# EAGLE schematic lego (EAGLE 6.4)
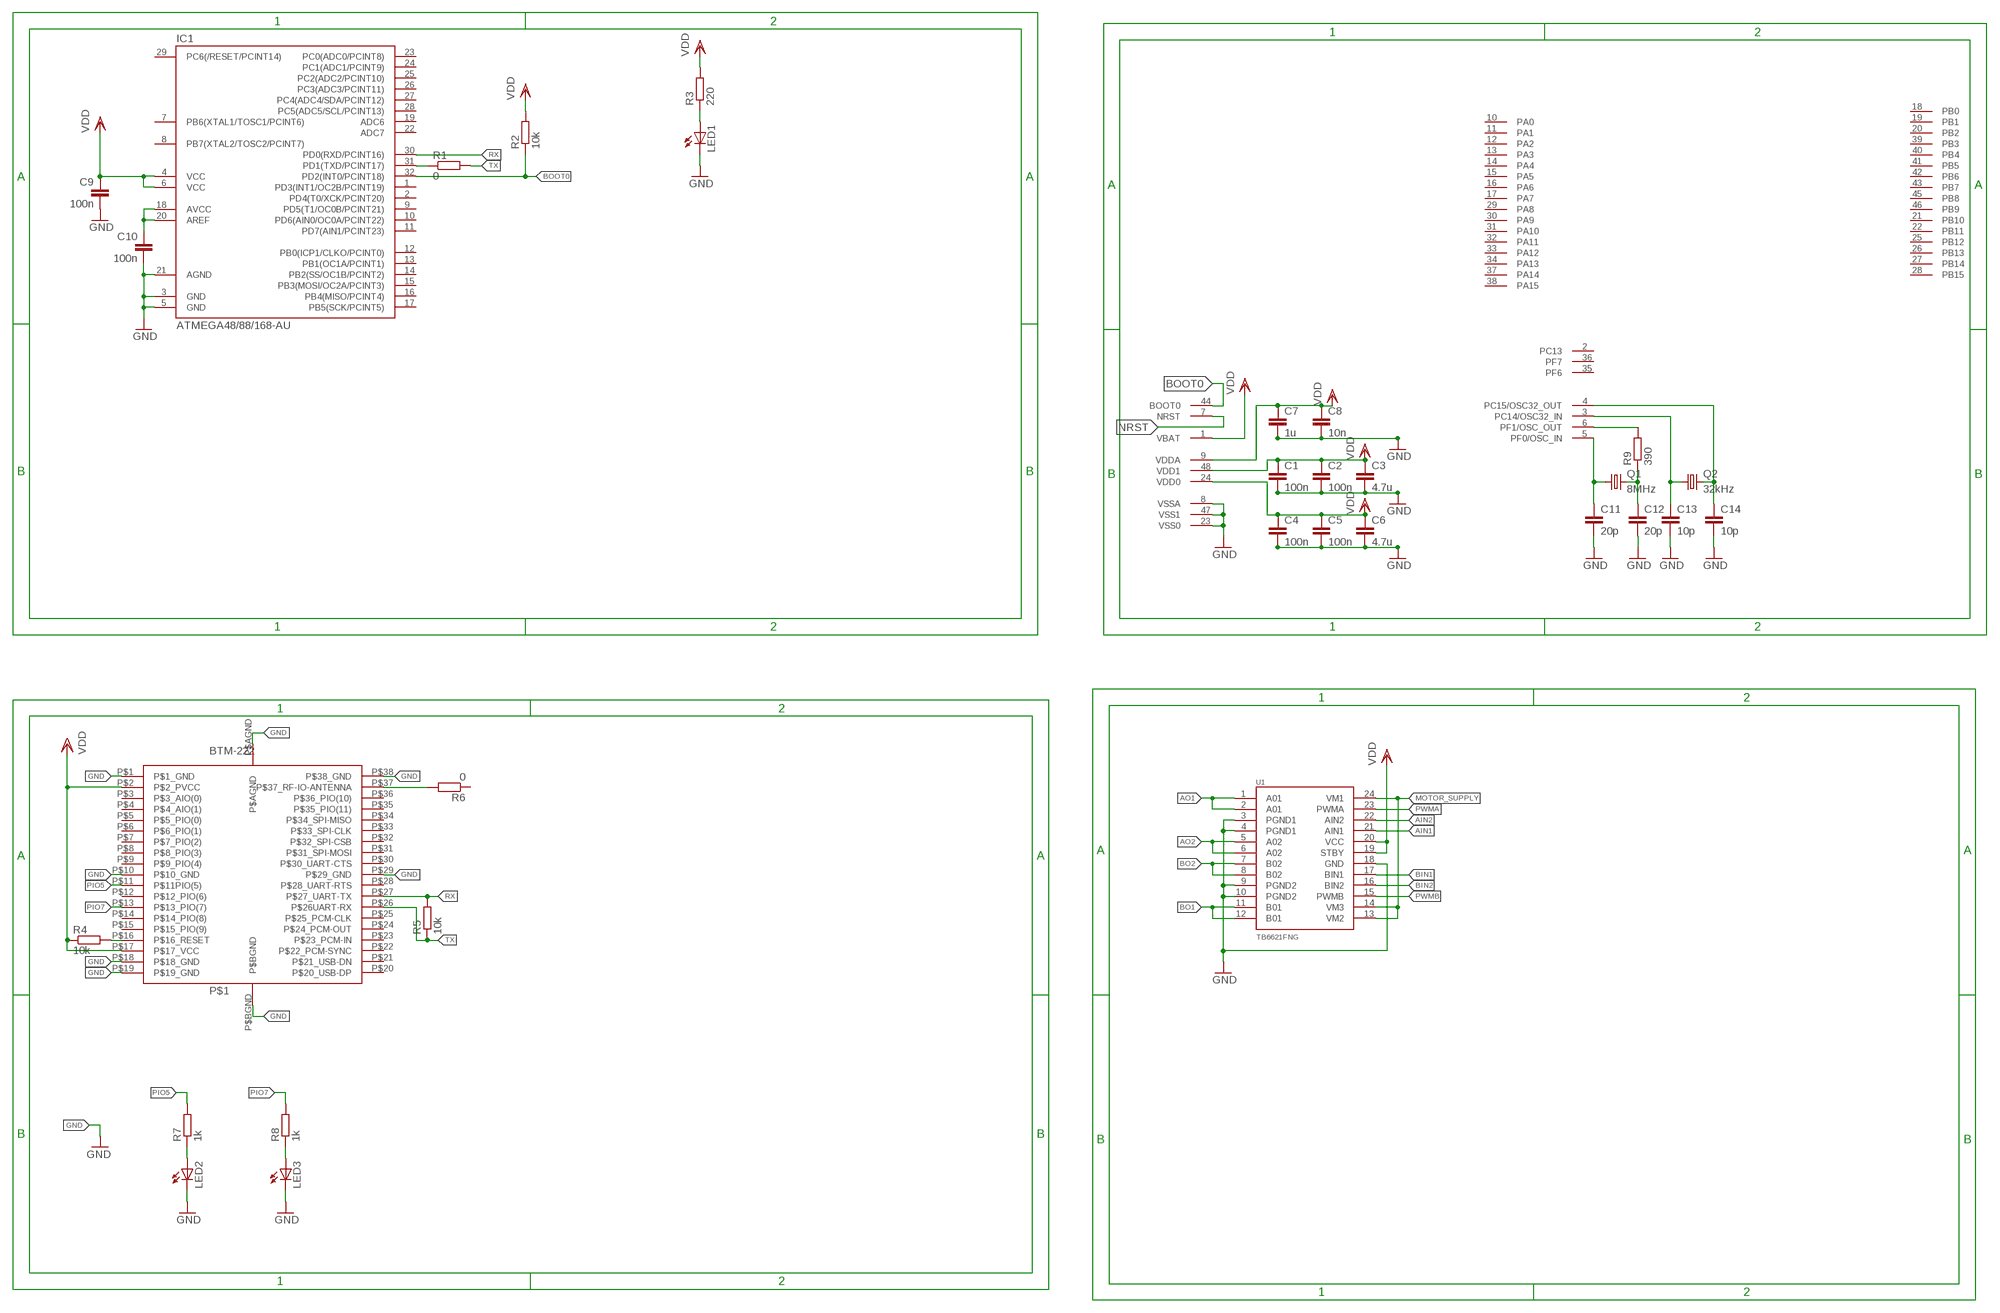
[diagram p0: schematic, sheet 1]

## Parts
C1  100n  C-EUC0805  [C0805]
C2  100n  C-EUC0805  [C0805]
C3  4.7u  C-EUC0805  [C0805]
C4  100n  C-EUC0805  [C0805]
C5  100n  C-EUC0805  [C0805]
C6  4.7u  C-EUC0805  [C0805]
C7  1u  C-EUC0805  [C0805]
C8  10n  C-EUC0805  [C0805]
C9  100n  C-EUC0805  [C0805]
C10  100n  C-EUC0805  [C0805]
C11  20p  C-EUC0805  [C0805]
C12  20p  C-EUC0805  [C0805]
C13  10p  C-EUC0805  [C0805]
C14  10p  C-EUC0805  [C0805]
IC1  ATMEGA48/88/168-AU  [TQFP32-08]
LED1  LEDSMT1206  [1206]
LED2  LEDSMT1206  [1206]
LED3  LEDSMT1206  [1206]
P$1  BTM-222  [BTM-222]
Q1  8MHz  CRYSTALHC49UP  [HC49UP]
Q2  32kHz  CRYSTALHC49UP  [HC49UP]
R1  0  R-EU_R0805  [R0805]
R2  10k  R-EU_R0805  [R0805]
R3  220  R-EU_R0805  [R0805]
R4  10k  R-EU_R0805  [R0805]
R5  10k  R-EU_R0805  [R0805]
R6  0  R-EU_R0805  [R0805]
R7  1k  R-EU_R0805  [R0805]
R8  1k  R-EU_R0805  [R0805]
R9  390  R-EU_R0805  [R0805]
U1  TB6621FNG  [SSOP24]
U$1  STM32F050  [LQFP48]

## Nets
AIN1: U1.21(AIN1)
AIN2: U1.22(AIN2)
AO1: U1.1(A01) U1.2(A01)
AO2: U1.5(A02) U1.6(A02)
BIN1: U1.17(BIN1)
BIN2: U1.16(BIN2)
BO1: U1.11(B01) U1.12(B01)
BO2: U1.7(B02) U1.8(B02)
BOOT0: IC1.32(PD2(INT0/PCINT18)) R2.1 U$1.44(BOOT0)
GND: C1.2 C2.2 C3.2 C4.2 C5.2 C6.2 C7.2 C8.2 C9.2 C10.2 C11.2 C12.2 C13.2 C14.2 IC1.3(GND) IC1.5(GND) IC1.21(AGND) LED1.C LED2.C LED3.C P$1.P$1(P$1_GND) P$1.P$10(P$10_GND) P$1.P$18(P$18_GND) P$1.P$19(P$19_GND) P$1.P$29(P$29_GND) P$1.P$38(P$38_GND) P$1.P$AGND P$1.P$BGND U1.3(PGND1) U1.4(PGND1) U1.9(PGND2) U1.10(PGND2) U1.18(GND) U$1.8(VSSA) U$1.23(VSS0) U$1.47(VSS1)
MOTOR_SUPPLY: U1.13(VM2) U1.14(VM3) U1.24(VM1)
N$1: IC1.31(PD1(TXD/PCINT17)) R1.1
N$2: C10.1 IC1.18(AVCC) IC1.20(AREF)
N$3: LED1.A R3.1
N$4: P$1.P$16(P$16_RESET) R4.2
N$5: P$1.P$37(P$37_RF-IO-ANTENNA) R6.2
N$6: LED2.A R7.1
N$7: LED3.A R8.1
N$8: R9.2 U$1.6(PF1/OSC_OUT)
N$9: C11.1 Q1.1 U$1.5(PF0/OSC_IN)
N$10: C12.1 Q1.2 R9.1
N$11: C13.1 Q2.1 U$1.3(PC14/OSC32_IN)
N$12: C14.1 Q2.2 U$1.4(PC15/OSC32_OUT)
NRST: U$1.7(NRST)
PIO5: P$1.P$11(P$11PIO(5)) R7.2
PIO7: P$1.P$13(P$13_PIO(7)) R8.2
PWMA: U1.23(PWMA)
PWMB: U1.15(PWMB)
RX: IC1.30(PD0(RXD/PCINT16)) P$1.P$27(P$27_UART-TX) R5.2
TX: P$1.P$26(P$26UART-RX) R1.2 R5.1
VDD: C1.1 C2.1 C3.1 C4.1 C5.1 C6.1 C7.1 C8.1 C9.1 IC1.4(VCC) IC1.6(VCC) P$1.P$2(P$2_PVCC) P$1.P$17(P$17_VCC) R2.2 R3.2 R4.1 U1.19(STBY) U1.20(VCC) U$1.1(VBAT) U$1.9(VDDA) U$1.24(VDD0) U$1.48(VDD1)
Unconnected: IC1.1(PD3(INT1/OC2B/PCINT19)) IC1.2(PD4(T0/XCK/PCINT20)) IC1.7(PB6(XTAL1/TOSC1/PCINT6)) IC1.8(PB7(XTAL2/TOSC2/PCINT7)) IC1.9(PD5(T1/OC0B/PCINT21)) IC1.10(PD6(AIN0/OC0A/PCINT22)) IC1.11(PD7(AIN1/PCINT23)) IC1.12(PB0(ICP1/CLKO/PCINT0)) IC1.13(PB1(OC1A/PCINT1)) IC1.14(PB2(SS/OC1B/PCINT2)) IC1.15(PB3(MOSI/OC2A/PCINT3)) IC1.16(PB4(MISO/PCINT4)) IC1.17(PB5(SCK/PCINT5)) IC1.19(ADC6) IC1.22(ADC7) IC1.23(PC0(ADC0/PCINT8)) IC1.24(PC1(ADC1/PCINT9)) IC1.25(PC2(ADC2/PCINT10)) IC1.26(PC3(ADC3/PCINT11)) IC1.27(PC4(ADC4/SDA/PCINT12)) IC1.28(PC5(ADC5/SCL/PCINT13)) IC1.29(PC6(/RESET/PCINT14)) P$1.P$3(P$3_AIO(0)) P$1.P$4(P$4_AIO(1)) P$1.P$5(P$5_PIO(0)) P$1.P$6(P$6_PIO(1)) P$1.P$7(P$7_PIO(2)) P$1.P$8(P$8_PIO(3)) P$1.P$9(P$9_PIO(4)) P$1.P$12(P$12_PIO(6)) P$1.P$14(P$14_PIO(8)) P$1.P$15(P$15_PIO(9)) P$1.P$20(P$20_USB-DP) P$1.P$21(P$21_USB-DN) P$1.P$22(P$22_PCM-SYNC) P$1.P$23(P$23_PCM-IN) P$1.P$24(P$24_PCM-OUT) P$1.P$25(P$25_PCM-CLK) P$1.P$28(P$28_UART-RTS) P$1.P$30(P$30_UART-CTS) P$1.P$31(P$31_SPI-MOSI) P$1.P$32(P$32_SPI-CSB) P$1.P$33(P$33_SPI-CLK) P$1.P$34(P$34_SPI-MISO) P$1.P$35(P$35_PIO(11)) P$1.P$36(P$36_PIO(10)) R6.1 U$1.2(PC13) U$1.10(PA0) U$1.11(PA1) U$1.12(PA2) U$1.13(PA3) U$1.14(PA4) U$1.15(PA5) U$1.16(PA6) U$1.17(PA7) U$1.18(PB0) U$1.19(PB1) U$1.20(PB2) U$1.21(PB10) U$1.22(PB11) U$1.25(PB12) U$1.26(PB13) U$1.27(PB14) U$1.28(PB15) U$1.29(PA8) U$1.30(PA9) U$1.31(PA10) U$1.32(PA11) U$1.33(PA12) U$1.34(PA13) U$1.35(PF6) U$1.36(PF7) U$1.37(PA14) U$1.38(PA15) U$1.39(PB3) U$1.40(PB4) U$1.41(PB5) U$1.42(PB6) U$1.43(PB7) U$1.45(PB8) U$1.46(PB9)

## Library data of the parts
C1-C14 = rcl:C-EU: CAPACITOR, European symbol
IC1 = atmega8:ATMEGA48/88/168
LED1-LED3 = led:LED: LED OSRAM: - CHIPLED LG R971, LG N971, LY N971, LG Q971, LY Q971, LO R971, LY R971 LH N974, LH R974 LS Q976, LO Q976, LY Q976 LO Q996 - Hyper CHIPLED LW Q18S LB Q993, LB Q99A, LB R99A - SideLED LS A670, LO A670, LY A670, LG A670, LP A670 LB A673, LV A673, LT A673, LW A673 LH A674 LY A675 LS A676, LA A676, LO A676, LY A676, LW A676 LS A679, LY A679, LG A679 - Hyper Micro SIDELED® LS Y876, LA Y876, LO Y876, LY Y876 LT Y87S - SmartLED LW L88C, LW L88S LB L89C, LB L89S, LG L890 LS L89K, LO L89K, LY L89K LS L896, LA L896, LO L896, LY L896 - TOPLED LS T670, LO T670, LY T670, LG T670, LP T670 LSG T670, LSP T670, LSY T670, LOP T670, LYG T670 LG T671, LOG T671, LSG T671 LB T673, LV T673, LT T673, LW T673 LH T674 LS T676, LA T676, LO T676, LY T676, LB T676, LH T676, LSB T676, LW T676 LB T67C, LV T67C, LT T67C, LS T67K, LO T67K, LY T67K, LW E67C LS E67B, LA E67B, LO E67B, LY E67B, LB E67C, LV E67C, LT E67C LW T67C LS T679, LY T679, LG T679 LS T770, LO T770, LY T770, LG T770, LP T770 LB T773, LV T773, LT T773, LW T773 LH T774 LS E675, LA E675, LY E675, LS T675 LS T776, LA T776, LO T776, LY T776, LB T776 LHGB T686 LT T68C, LB T68C - Hyper Mini TOPLED® LB M676 - Mini TOPLED Santana® LG M470 LS M47K, LO M47K, LY M47K Source: http://www.osram.convergy.de LUXEON: - LUMILED® LXK2-PW12-R00, LXK2-PW12-S00, LXK2-PW14-U00, LXK2-PW14-V00 LXK2-PM12-R00, LXK2-PM12-S00, LXK2-PM14-U00 LXK2-PE12-Q00, LXK2-PE12-R00, LXK2-PE12-S00, LXK2-PE14-T00, LXK2-PE14-U00 LXK2-PB12-K00, LXK2-PB12-L00, LXK2-PB12-M00, LXK2-PB14-N00, LXK2-PB14-P00, LXK2-PB14-Q00 LXK2-PR12-L00, LXK2-PR12-M00, LXK2-PR14-Q00, LXK2-PR14-R00 LXK2-PD12-Q00, LXK2-PD12-R00, LXK2-PD12-S00 LXK2-PH12-R00, LXK2-PH12-S00 LXK2-PL12-P00, LXK2-PL12-Q00, LXK2-PL12-R00 Source: www.luxeon.com KINGBRIGHT: KA-3528ASYC Source: www.kingbright.com
P$1 = btm-222:BTM-222: Rayson BTM-222 Bluetooth Modul all Pins
Q1 Q2 = crystal:CRYSTAL: CRYSTAL; OC_FARNELL: unknown; OC_NEWARK: unknown
R1-R9 = rcl:R-EU_: RESISTOR, European symbol
U1 = SparkFun:TB6621FNG: Toshiba 1A motor driver
U$1 = stm32f0:STM32F050